# Altium schematic sheet EGB220.SchDoc: Test
size A3; Author: John Hatfield; DrawnBy: John Hatfield; SheetNumber: 1; SheetTotal: 6
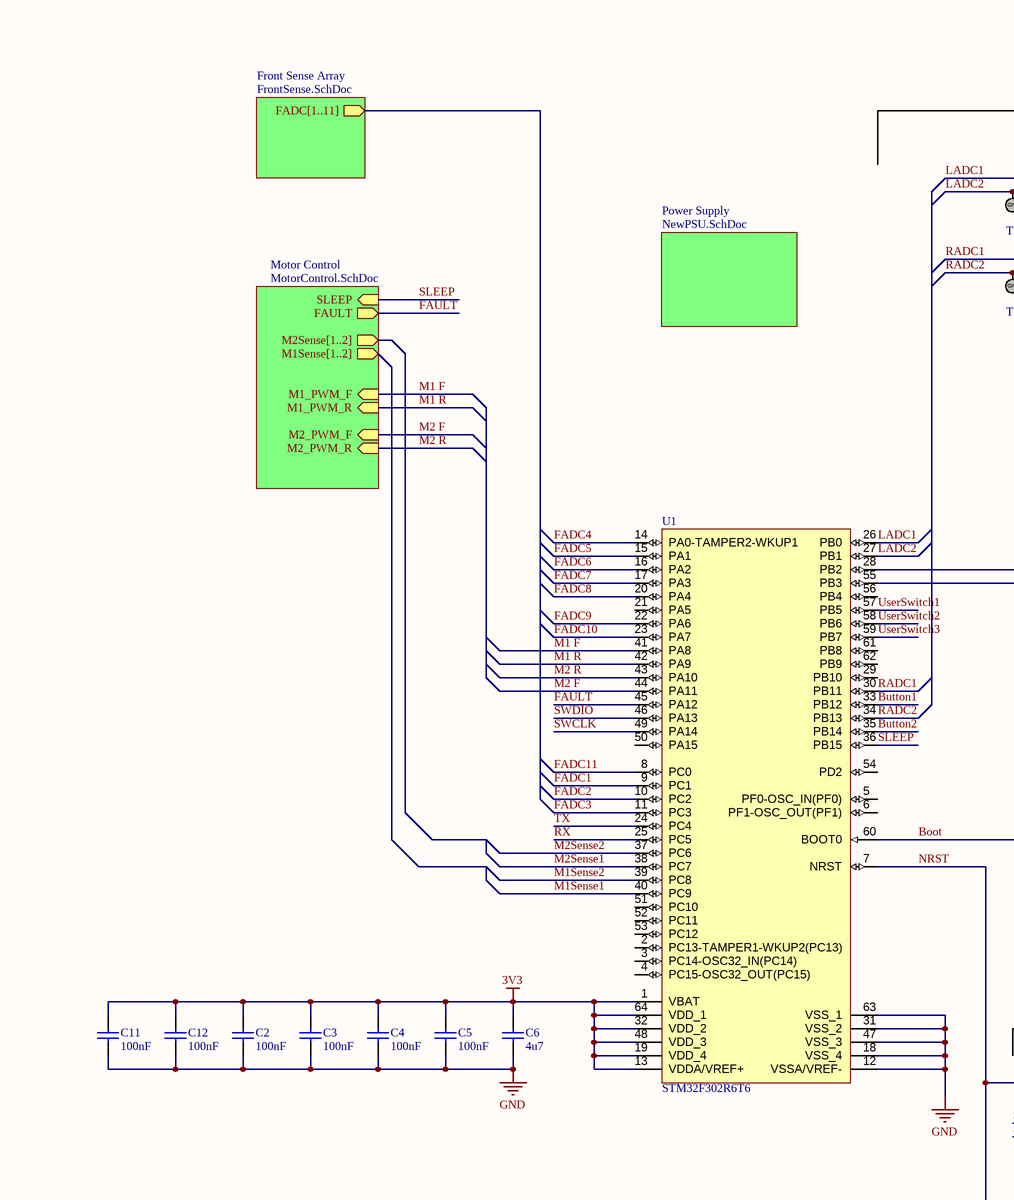
[diagram p0: EGB220.SchDoc, centre column 2 of 4]
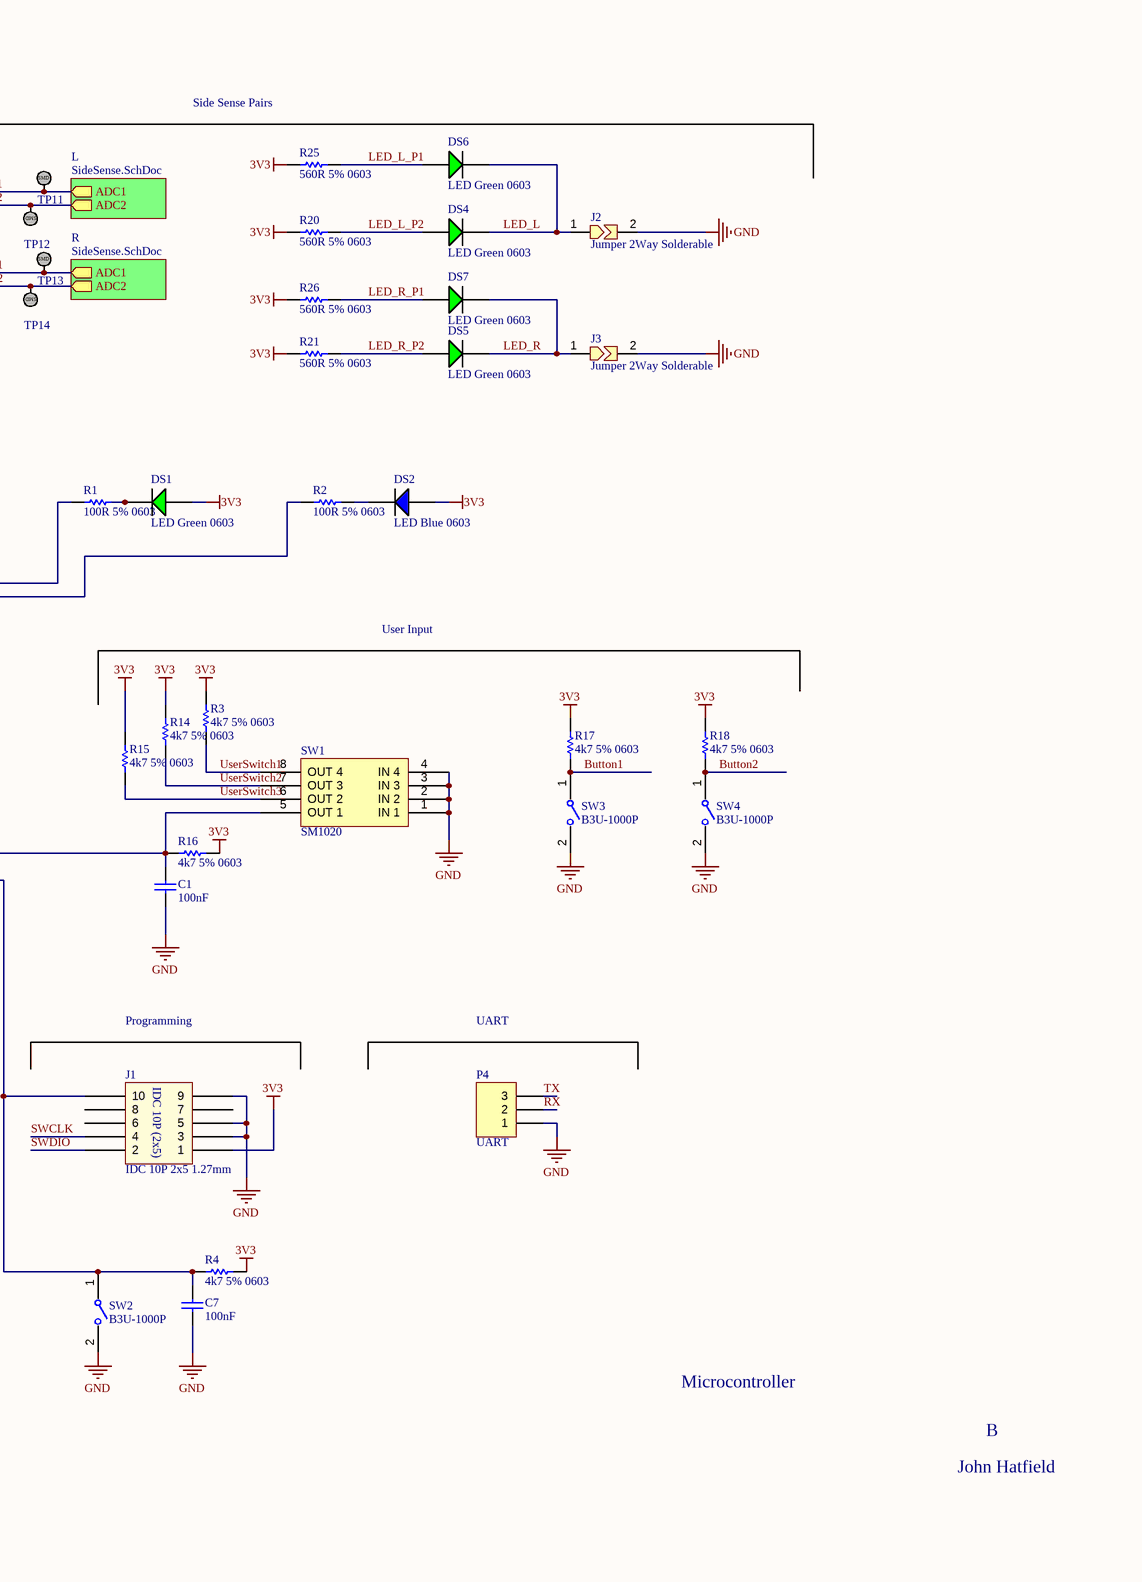
[diagram p1: EGB220.SchDoc, centre column 3 of 4]

## Parts
C1  100nF  [Cap_Ceramic_0603]
C2  100nF  [Cap_Ceramic_0603]
C3  100nF  [Cap_Ceramic_0603]
C4  100nF  [Cap_Ceramic_0603]
C5  100nF  [Cap_Ceramic_0603]
C6  4u7  [Cap_Ceramic_0603]
C7  100nF  [Cap_Ceramic_0603]
C11  100nF  [Cap_Ceramic_0603]
C12  100nF  [Cap_Ceramic_0603]
DS1  LED Green 0603  [LED GREEN 0603]
DS2  LED Blue 0603  [LED BLUE 0603]
DS4  LED Green 0603  [LED GREEN 0603]
DS5  LED Green 0603  [LED GREEN 0603]
DS6  LED Green 0603  [LED GREEN 0603]
DS7  LED Green 0603  [LED GREEN 0603]
J1  IDC 10P 2x5 1.27mm  [IDC 1.27MM 10P]
J2  Jumper 2Way Solderable  [Jumper_2Way_Solderable]
J3  Jumper 2Way Solderable  [Jumper_2Way_Solderable]
P4  UART  [HDR1X3]
R1  100R 5% 0603  [Res_ThinFilm_0603]
R2  100R 5% 0603  [Res_ThinFilm_0603]
R3  4k7 5% 0603  [Res_ThinFilm_0603]
R4  4k7 5% 0603  [Res_ThinFilm_0603]
R14  4k7 5% 0603  [Res_ThinFilm_0603]
R15  4k7 5% 0603  [Res_ThinFilm_0603]
R16  4k7 5% 0603  [Res_ThinFilm_0603]
R17  4k7 5% 0603  [Res_ThinFilm_0603]
R18  4k7 5% 0603  [Res_ThinFilm_0603]
R20  560R 5% 0603  [Res_ThinFilm_0603]
R21  560R 5% 0603  [Res_ThinFilm_0603]
R25  560R 5% 0603  [Res_ThinFilm_0603]
R26  560R 5% 0603  [Res_ThinFilm_0603]
SW1  SM1020  [SM1020]
SW2  B3U-1000P  [FP-B3U-1000P-MFG]
SW3  B3U-1000P  [FP-B3U-1000P-MFG]
SW4  B3U-1000P  [FP-B3U-1000P-MFG]
TP11  TestPoint_SMD  [TestPointSMD]  (value not drawn)
TP12  TestPoint_SMD  [TestPointSMD]  (value not drawn)
TP13  TestPoint_SMD  [TestPointSMD]  (value not drawn)
TP14  TestPoint_SMD  [TestPointSMD]  (value not drawn)
U1  STM32F302R6T6  [STM-LQFP64_L]

## Sub-sheets
Front Sense Array = FrontSense.SchDoc: FADC[1..11] (out)
L = SideSense.SchDoc: ADC1 (out), ADC2 (out)
Motor Control = MotorControl.SchDoc: M2Sense[1..2] (out), M1Sense[1..2] (out), M1_PWM_F (in), M1_PWM_R (in), M2_PWM_F (in), M2_PWM_R (in), FAULT (out), SLEEP (in)
Power Supply = NewPSU.SchDoc: no entries
R = SideSense.SchDoc: ADC1 (out), ADC2 (out)

## Nets
3V3: C2.2 C3.2 C4.2 C5.2 C6.2 C11.2 C12.2 DS1.1(A) DS2.1(A) J1.1 R3.2 R4.1 R14.2 R15.2 R16.1 R17.2 R18.2 R20.2 R21.2 R25.2 R26.2 U1.1(VBAT) U1.13(VDDA/VREF+) U1.19(VDD_4) U1.32(VDD_2) U1.48(VDD_3) U1.64(VDD_1)
GND: C1.1 C2.1 C3.1 C4.1 C5.1 C6.1 C7.1 C11.1 C12.1 J1.3 J1.5 J1.9 J2.2 J3.2 P4.1 SW1.1(IN_1) SW1.2(IN_2) SW1.3(IN_3) SW1.4(IN_4) SW2.2 SW3.2 SW4.2 U1.12(VSSA/VREF-) U1.18(VSS_4) U1.31(VSS_2) U1.47(VSS_3) U1.63(VSS_1)
Boot: C1.2 R16.2 SW1.5(OUT_1) U1.60(BOOT0)
Button1: R17.1 SW3.1 U1.33(PB12)
Button2: R18.1 SW4.1 U1.35(PB14)
FADC1: U1.9(PC1)
FADC2: U1.10(PC2)
FADC3: U1.11(PC3)
FADC4: U1.14(PA0-TAMPER2-WKUP1)
FADC5: U1.15(PA1)
FADC6: U1.16(PA2)
FADC7: U1.17(PA3)
FADC8: U1.20(PA4)
FADC9: U1.22(PA6)
FADC10: U1.23(PA7)
FADC11: U1.8(PC0)
FAULT: U1.45(PA12) ; sheet Motor Control/FAULT
LADC1: TP11.1 U1.26(PB0) ; sheet L/ADC1
LADC2: TP12.1 U1.27(PB1) ; sheet L/ADC2
LED_L: DS4.2(C) DS6.2(C) J2.1
LED_L_P1: DS6.1(A) R25.1
LED_L_P2: DS4.1(A) R20.1
LED_R: DS5.2(C) DS7.2(C) J3.1
LED_R_P1: DS7.1(A) R26.1
LED_R_P2: DS5.1(A) R21.1
M1 F: U1.41(PA8) ; sheet Motor Control/M1_PWM_F
M1 R: U1.42(PA9) ; sheet Motor Control/M1_PWM_R
M1Sense1: U1.40(PC9)
M1Sense2: U1.39(PC8)
M2 F: U1.44(PA11) ; sheet Motor Control/M2_PWM_F
M2 R: U1.43(PA10) ; sheet Motor Control/M2_PWM_R
M2Sense1: U1.38(PC7)
M2Sense2: U1.37(PC6)
NRST: C7.2 J1.10 R4.2 SW2.1 U1.7(NRST)
RADC1: TP13.1 U1.30(PB11) ; sheet R/ADC1
RADC2: TP14.1 U1.34(PB13) ; sheet R/ADC2
RX: P4.2 U1.25(PC5)
SLEEP: U1.36(PB15) ; sheet Motor Control/SLEEP
SWCLK: J1.4 U1.49(PA14)
SWDIO: J1.2 U1.46(PA13)
TX: P4.3 U1.24(PC4)
UserSwitch1: R3.1 SW1.8(OUT_4) U1.57(PB5)
UserSwitch2: R14.1 SW1.7(OUT_3) U1.58(PB6)
UserSwitch3: R15.1 SW1.6(OUT_2) U1.59(PB7)
NetDS1_2: DS1.2(C) R1.2
NetDS2_2: DS2.2(C) R2.2
NetR1_1: R1.1 U1.28(PB2)
NetR2_1: R2.1 U1.55(PB3)

Not connected (* = marked no-connect by the designer): J1 6 7 8; U1 2(PC13-TAMPER1-WKUP2(PC13)) 3(PC14-OSC32_IN(PC14)) 4(PC15-OSC32_OUT(PC15)) 5(PF0-OSC_IN(PF0)) 6(PF1-OSC_OUT(PF1)) 21(PA5) 29(PB10) 50(PA15) 51(PC10) 52(PC11) 53(PC12) 54(PD2) 56(PB4) 61(PB8) 62(PB9)

## Notes on the sheet
- Side Sense Pairs
- User Input
- Programming
- UART
- Microcontroller
- B
- John Hatfield
- (in symbol IDC 10P 2x5 1.27mm) IDC 10P (2x5)
- (in symbol TestPoint_SMD) SMD

## Library data of the parts
C1-C5 C7 C11 C12 = 100nF 50V 5% X7R 0603: Capacitor, Ceramic, SMD, 100nF, 50V, 5%, X7R, 0603
C6 = 4u7 50V 5% X7R 0603: Capacitor, Ceramic, SMD, 4u7, 50V, 5%, X7R, 0603
J2 J3 = Jumper 2Way Vert Solderable
P4 = Header 3: Header, 3-Pin; LatestRevisionDate: 17-Jul-2002; LatestRevisionNote: Re-released for DXP Platform.; Publisher: Altium Limited
R1 R2 = 100R 5%, 0603: Resistor, SMD, 100R, 0.1W, 5%, 0603
R3 R4 R14-R18 = 4k7 5% 0603: Resistor, SMD, 4k7, 0.1W, 5%, 0603
R20 R21 R25 R26 = 560R 5% 0603: Resistor, SMD, 560R, 0.1W, 5%, 0603
SW1 = SM1020: 4 Pin DIL Switch
SW2-SW4 = CMP-2100-03586-2: SWITCH TACTILE SPST-NO 0.05A 12V; Contact Resistance: 100mR; Operating Force: 1.5N; Max Current Rating: 50mA; Switch Travel: 0.15mm; Actuator Type: Standard; Mechanical Life: 200000Cycles; Ratings: Dust Proof; Illumination Type: Non-Illuminated; Throw Configuration: SPST; Actuator Length: 0.4mm; Switch Function: Off-Mom; Height: 1.2mm; Width: 3mm; Weight: 0.000776oz; Contact Material: Silver; Max Voltage Rating (DC): 12V; Insulation Resistance: 100MR; Lead Free: Lead Free; Current Rating: 50mA; Termination: SMD/SMT; Length: 4mm; Voltage Rating (DC): 12V; Contact Current Rating: 50mA; Orientation: Straight; Depth: 2.5mm; Max Operating Temperature: 70°C; Packaging: Tape and Reel; Min Operating Temperature: -25°C; Package Quantity: 1; Mount: Surface Mount; Electrical Life: 200000Cycles
U1 = CMP-0537-00017-1: ARM Cortex-M4 32-bit MCU, 32 KB Flash, 16 KB Internal RAM, 51 I/Os, 64-Pin LQFP, -40 to 85 degC, Tray; Operating Frequency(F) (Processor speed) (MHz): 72; Internal RAM Size (kB): 16; I/Os (High Current): 51; Supply Voltage(Vcc) min (V): 2; FLASH Size (Prog) (kB): 32; D/A Converter: 1; ComponentLink1Description: Manufacturer URL; Core: ARM Cortex-M4; Mounting Technology: Surface Mount; Packing: Tray; Package Description: 64-Pin Low-profile Quad Flat Package, Body 10 x 10 mm, Pitch 0.5 mm; ComponentLink2URL: http://www.st.com/st-web-ui/static/active/en/resource/technical/document/datasheet/DM00093333.pdf; Package Reference: LQFP64; ComponentLink1URL: http://www.st.com/; ComponentLink2Description: Datasheet; DatasheetVersion: Rev. 5